# Altium schematic sheet BrakeLightNM.SchDoc
size A4
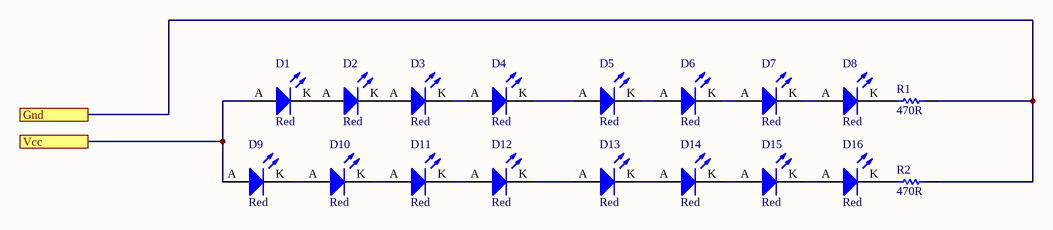
[diagram p0: BrakeLightNM.SchDoc]

## Parts
D1  Red  [0805 LED]
D2  Red  [0805 LED]
D3  Red  [0805 LED]
D4  Red  [0805 LED]
D5  Red  [0805 LED]
D6  Red  [0805 LED]
D7  Red  [0805 LED]
D8  Red  [0805 LED]
D9  Red  [0805 LED]
D10  Red  [0805 LED]
D11  Red  [0805 LED]
D12  Red  [0805 LED]
D13  Red  [0805 LED]
D14  Red  [0805 LED]
D15  Red  [0805 LED]
D16  Red  [0805 LED]
R1  470R  [0805]
R2  470R  [0805]

## Ports
Gnd, Vcc

## Nets
Gnd: R1.2 R2.2 ; port Gnd
Vcc: D1.A D9.A ; port Vcc
NetD1_K: D1.K D2.A
NetD2_K: D2.K D3.A
NetD3_K: D3.K D4.A
NetD4_K: D4.K D5.A
NetD5_K: D5.K D6.A
NetD6_K: D6.K D7.A
NetD7_K: D7.K D8.A
NetD8_K: D8.K R1.1
NetD9_K: D9.K D10.A
NetD10_K: D10.K D11.A
NetD11_K: D11.K D12.A
NetD12_K: D12.K D13.A
NetD13_K: D13.K D14.A
NetD14_K: D14.K D15.A
NetD15_K: D15.K D16.A
NetD16_K: D16.K R2.1

## Library data of the parts
D1-D16 = SML-210LTT86: Red LED Indication - Discrete 1.75V 0805 (2012 Metric); Manufacturer: ROHM Semiconductor; Part Number: SML-210LTT86; Colour: Red; Digikey Part Number: 511-1286-1-ND; Digikey Link: https://www.digikey.com/product-detail/en/rohm-semiconductor/SML-210LTT86/511-1286-1-ND/637099
R1 R2 = RC0805FR07470RL: Manufacturer: YAGEO; Tolerance: 0.01; Rated Voltage: 0.125W; Part Number: RC0805FR07470RL; Value: 470R; Material: FR-07; Digikey Part Number: 311-470CRCT-ND